# Altium schematic sheet S7CAS-PLEIADES-CARTE-MERE_P01_FPGA-BANK2.SchDoc
size Tabloid; DocumentNumber: 13; SheetNumber: 13; SheetTotal: 17; Sheet_Name: FPGA - BANK 2; Size: 11x17
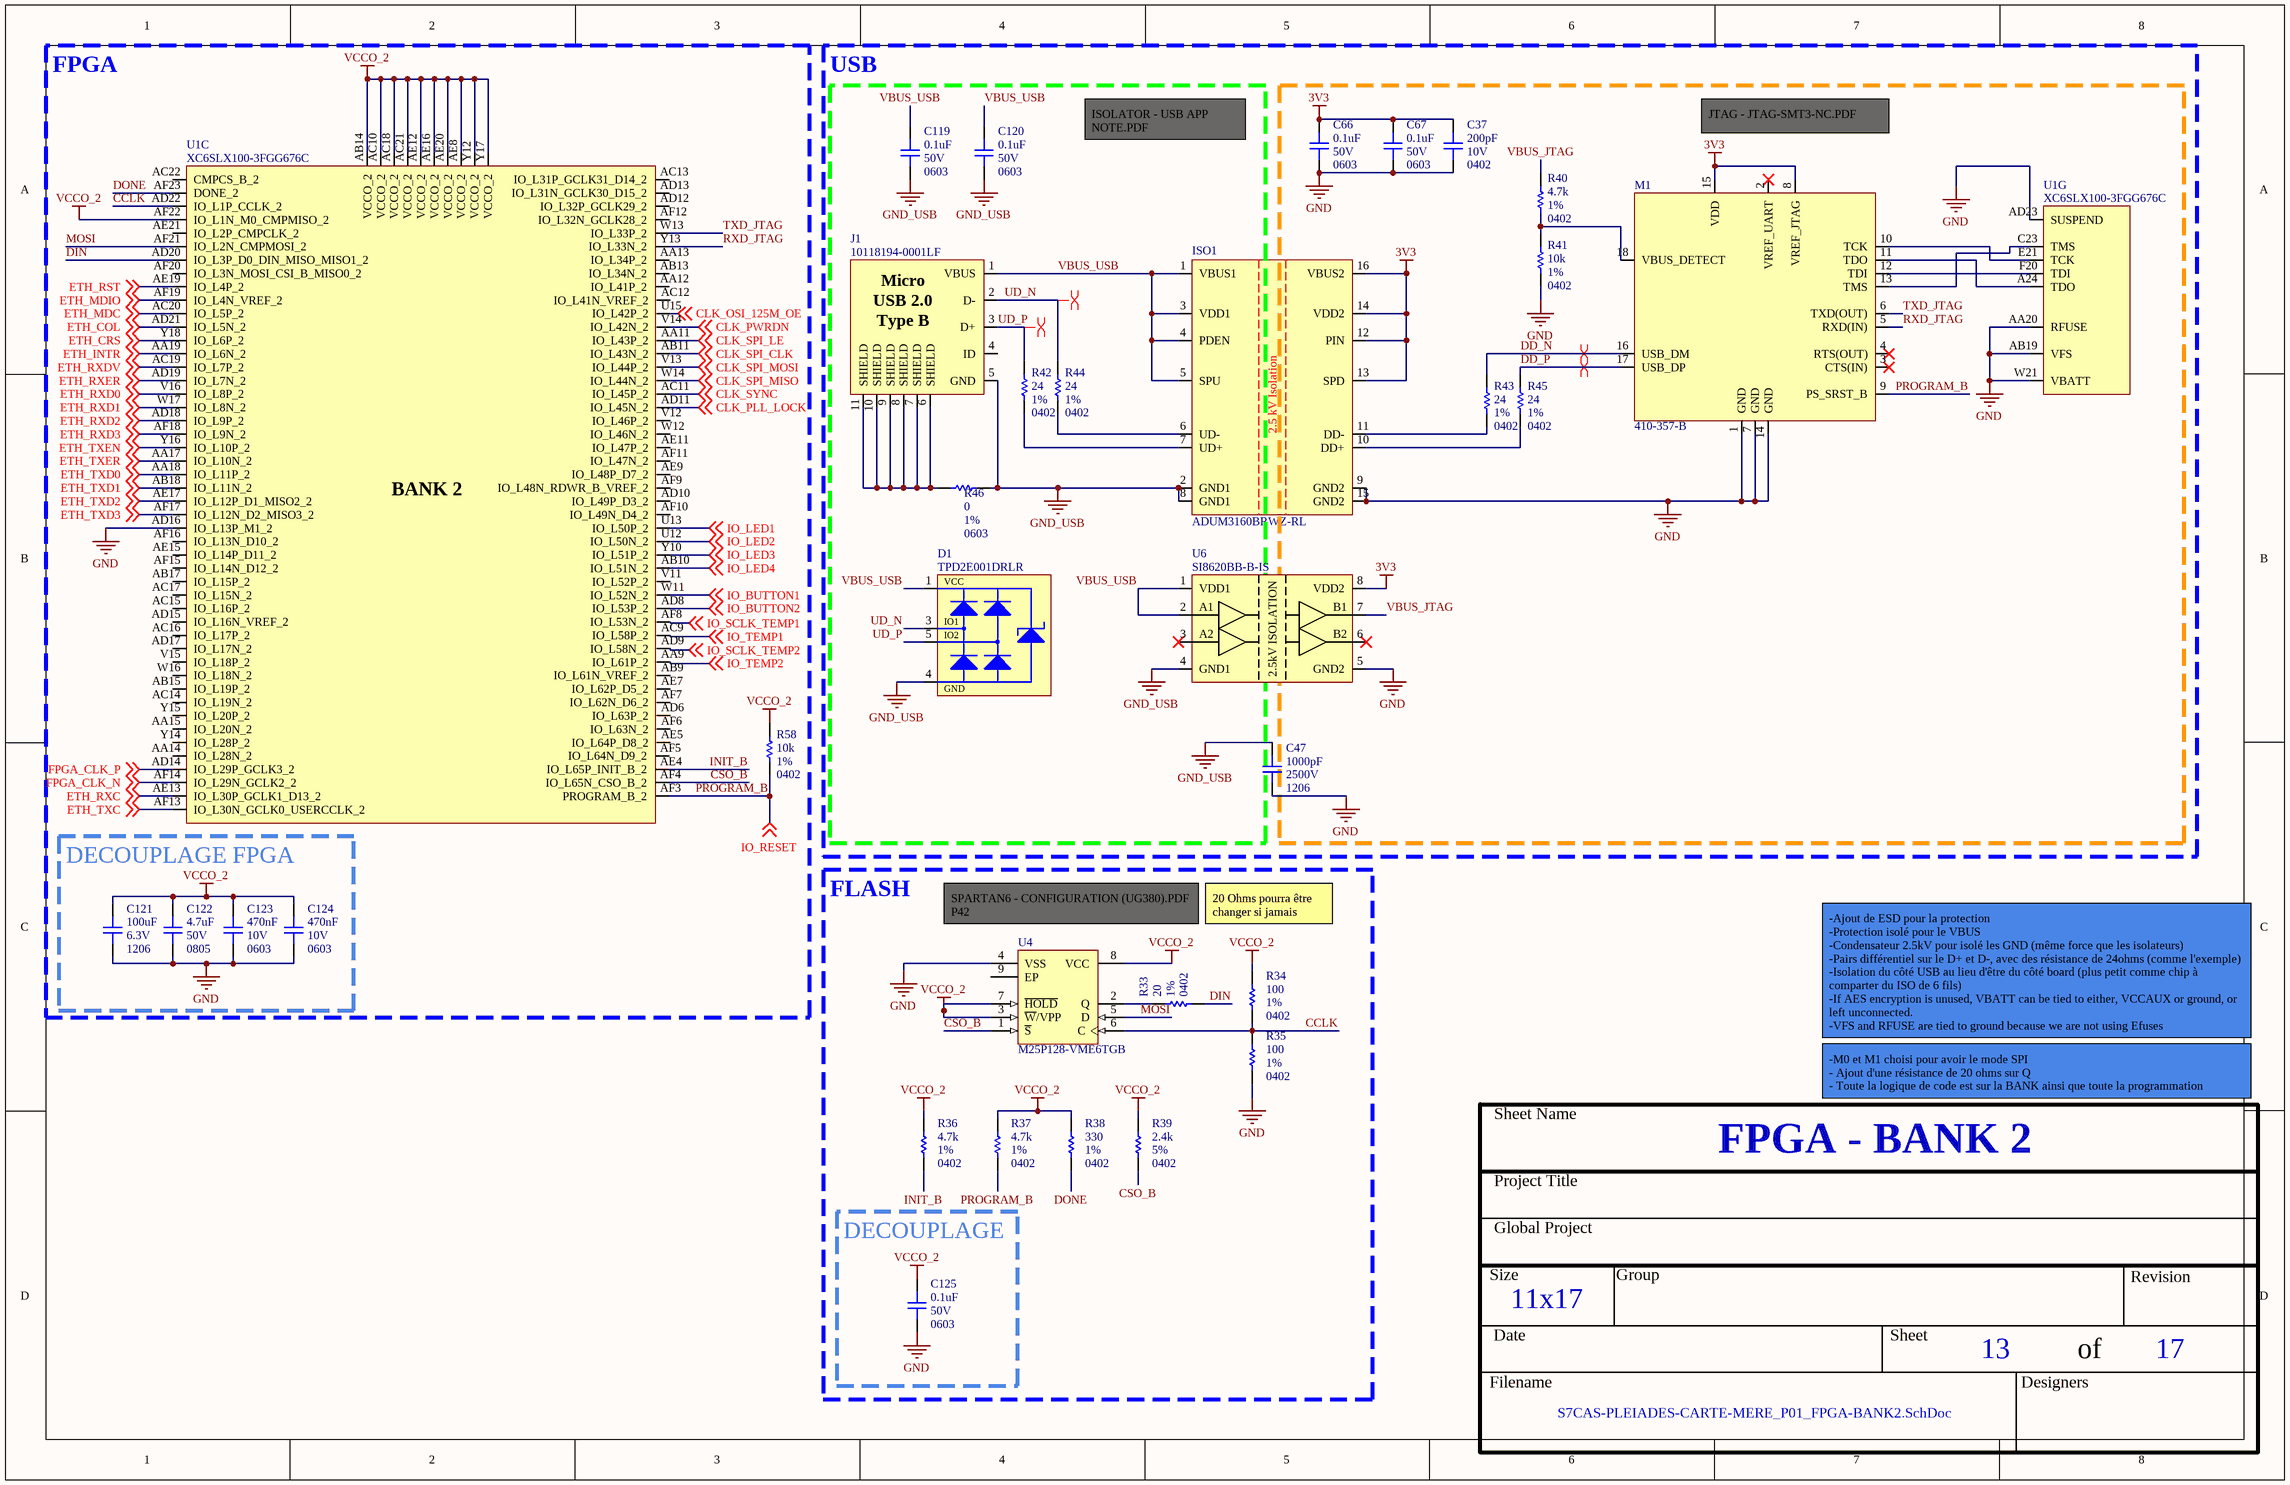
[diagram p0: S7CAS-PLEIADES-CARTE-MERE_P01_FPGA-BANK2.SchDoc]

## Parts
C37  value 200pF  Voltage: 10V  Package: 0402  [CAP_0402]  (hidden comment: CAP - 0402)
C47  value 1000pF  Voltage: 2500V  Package: 1206  [CAP_1206]  (hidden comment: CAP - 1206)
C66  value 0.1uF  Voltage: 50V  Package: 0603  [CAP_0603]  (hidden comment: CAP - 0603)
C67  value 0.1uF  Voltage: 50V  Package: 0603  [CAP_0603]  (hidden comment: CAP - 0603)
C119  value 0.1uF  Voltage: 50V  Package: 0603  [CAP_0603]  (hidden comment: CAP - 0603)
C120  value 0.1uF  Voltage: 50V  Package: 0603  [CAP_0603]  (hidden comment: CAP - 0603)
C121  value 100uF  Voltage: 6.3V  Package: 1206  [CAP_1206]  (hidden comment: CAP - 1206)
C122  value 4.7uF  Voltage: 50V  Package: 0805  [CAP_0805]  (hidden comment: CAP - 0805)
C123  value 470nF  Voltage: 10V  Package: 0603  [CAP_0603]  (hidden comment: CAP - 0603)
C124  value 470nF  Voltage: 10V  Package: 0603  [CAP_0603]  (hidden comment: CAP - 0603)
C125  value 0.1uF  Voltage: 50V  Package: 0603  [CAP_0603]  (hidden comment: CAP - 0603)
D1  TPD2E001DRLR  [TVS_USB_TPD2E001DRLR]
ISO1  ADUM3160BRWZ-RL  [ISO_ADUM3160BRWZ-RL]
J1  10118194-0001LF  [CON_USB_10118194-0001LF]
M1  410-357-B  [MOD_JTAG_410-357-B]
R33  value 20  Package: 0402  Precision: 1%  [RES_0402]  (hidden comment: RES - 0402)
R34  value 100  Package: 0402  Precision: 1%  [RES_0402]  (hidden comment: RES - 0402)
R35  value 100  Package: 0402  Precision: 1%  [RES_0402]  (hidden comment: RES - 0402)
R36  value 4.7k  Package: 0402  Precision: 1%  [RES_0402]  (hidden comment: RES - 0402)
R37  value 4.7k  Package: 0402  Precision: 1%  [RES_0402]  (hidden comment: RES - 0402)
R38  value 330  Package: 0402  Precision: 1%  [RES_0402]  (hidden comment: RES - 0402)
R39  value 2.4k  Package: 0402  Precision: 5%  [RES_0402]  (hidden comment: RES - 0402)
R40  value 4.7k  Package: 0402  Precision: 1%  [RES_0402]  (hidden comment: RES - 0402)
R41  value 10k  Package: 0402  Precision: 1%  [RES_0402]  (hidden comment: RES - 0402)
R42  value 24  Package: 0402  Precision: 1%  [RES_0402]  (hidden comment: RES - 0402)
R43  value 24  Package: 0402  Precision: 1%  [RES_0402]  (hidden comment: RES - 0402)
R44  value 24  Package: 0402  Precision: 1%  [RES_0402]  (hidden comment: RES - 0402)
R45  value 24  Package: 0402  Precision: 1%  [RES_0402]  (hidden comment: RES - 0402)
R46  value 0  Package: 0603  Precision: 1%  [RES_0603]  (hidden comment: RES - 0603)
R58  value 10k  Package: 0402  Precision: 1%  [RES_0402]  (hidden comment: RES - 0402)
U1  XC6SLX100-3FGG676C  [FPGA_XILINX_FGG676]  (parts C,G of 10)
U4  M25P128-VME6TGB  [MICT-VDFPN-8_M]
U6  SI8620BB-B-IS  [ISO_SI8620BB-B-IS]

## Blocks framed on the sheet
FPGA: R58 U1
USB: C119 C120 D1 J1 R42 R44 R46
DECOUPLAGE FPGA: C121-C124
FLASH: R33-R39 U4
DECOUPLAGE: C125

## Nets
3V3: C37.2 C66.2 C67.2 ISO1.12(PIN) ISO1.13(SPD) ISO1.14(VDD2) ISO1.16(VBUS2) M1.8(VREF_JTAG) M1.15(VDD) U6.8(VDD2)
GND: C37.1 C47.1 C66.1 C67.1 C121.1 C122.1 C123.1 C124.1 C125.1 ISO1.9(GND2) ISO1.15(GND2) M1.1(GND) M1.7(GND) M1.14(GND) R35.1 R41.1 U1.AA20(RFUSE) U1.AB19(VFS) U1.AD16(IO_L13P_M1_2) U1.AD23(SUSPEND) U1.W21(VBATT) U4.4(VSS) U6.5(GND2)
GND_USB: C47.2 C119.1 C120.1 D1.4(GND) ISO1.2(GND1) ISO1.8(GND1) J1.5(GND) R46.1 U6.4(GND1)
VCCO_2: C121.2 C122.2 C123.2 C124.2 C125.2 R34.2 R36.2 R37.2 R38.2 R39.2 R58.2 U1.AB14(VCCO_2) U1.AC10(VCCO_2) U1.AC18(VCCO_2) U1.AC21(VCCO_2) U1.AE8(VCCO_2) U1.AE12(VCCO_2) U1.AE16(VCCO_2) U1.AE20(VCCO_2) U1.AF22(IO_L1N_M0_CMPMISO_2) U1.Y12(VCCO_2) U1.Y17(VCCO_2) U4.3(~{W}/VPP) U4.7(~{HOLD}) U4.8(VCC)
CCLK: R34.1 R35.2 U1.AD22(IO_L1P_CCLK_2) U4.6(C)
CLK_OSI_125M_OE: U1.U15(IO_L42P_2) ; off-sheet CLK_OSI_125M_OE
CLK_PLL_LOCK: U1.AD11(IO_L45N_2) ; off-sheet CLK_PLL_LOCK
CLK_PWRDN: U1.V14(IO_L42N_2) ; off-sheet CLK_PWRDN
CLK_SPI_CLK: U1.AB11(IO_L43N_2) ; off-sheet CLK_SPI_CLK
CLK_SPI_LE: U1.AA11(IO_L43P_2) ; off-sheet CLK_SPI_LE
CLK_SPI_MISO: U1.W14(IO_L44N_2) ; off-sheet CLK_SPI_MISO
CLK_SPI_MOSI: U1.V13(IO_L44P_2) ; off-sheet CLK_SPI_MOSI
CLK_SYNC: U1.AC11(IO_L45P_2) ; off-sheet CLK_SYNC
CSO_B: R39.1 U1.AF4(IO_L65N_CSO_B_2) U4.1(~{S})
DD_N: M1.16(USB_DM) R43.2
DD_P: M1.17(USB_DP) R45.2
DIN: R33.1 U1.AD20(IO_L3P_D0_DIN_MISO_MISO1_2)
DONE: R38.1 U1.AF23(DONE_2)
ETH_COL: U1.AD21(IO_L5N_2) ; off-sheet ETH_COL
ETH_CRS: U1.Y18(IO_L6P_2) ; off-sheet ETH_CRS
ETH_INTR: U1.AA19(IO_L6N_2) ; off-sheet ETH_INTR
ETH_MDC: U1.AC20(IO_L5P_2) ; off-sheet ETH_MDC
ETH_MDIO: U1.AF19(IO_L4N_VREF_2) ; off-sheet ETH_MDIO
ETH_RST: U1.AE19(IO_L4P_2) ; off-sheet ETH_RST
ETH_RXC: U1.AE13(IO_L30P_GCLK1_D13_2) ; off-sheet ETH_RXC
ETH_RXD0: U1.V16(IO_L8P_2) ; off-sheet ETH_RXD0
ETH_RXD1: U1.W17(IO_L8N_2) ; off-sheet ETH_RXD1
ETH_RXD2: U1.AD18(IO_L9P_2) ; off-sheet ETH_RXD2
ETH_RXD3: U1.AF18(IO_L9N_2) ; off-sheet ETH_RXD3
ETH_RXDV: U1.AC19(IO_L7P_2) ; off-sheet ETH_RXDV
ETH_RXER: U1.AD19(IO_L7N_2) ; off-sheet ETH_RXER
ETH_TXC: U1.AF13(IO_L30N_GCLK0_USERCCLK_2) ; off-sheet ETH_TXC
ETH_TXD0: U1.AA18(IO_L11P_2) ; off-sheet ETH_TXD0
ETH_TXD1: U1.AB18(IO_L11N_2) ; off-sheet ETH_TXD1
ETH_TXD2: U1.AE17(IO_L12P_D1_MISO2_2) ; off-sheet ETH_TXD2
ETH_TXD3: U1.AF17(IO_L12N_D2_MISO3_2) ; off-sheet ETH_TXD3
ETH_TXEN: U1.Y16(IO_L10P_2) ; off-sheet ETH_TXEN
ETH_TXER: U1.AA17(IO_L10N_2) ; off-sheet ETH_TXER
FPGA_CLK_N: U1.AF14(IO_L29N_GCLK2_2) ; off-sheet FPGA_CLK_N
FPGA_CLK_P: U1.AD14(IO_L29P_GCLK3_2) ; off-sheet FPGA_CLK_P
INIT_B: R36.1 U1.AE4(IO_L65P_INIT_B_2)
IO_BUTTON1: U1.W11(IO_L52N_2) ; off-sheet IO_BUTTON1
IO_BUTTON2: U1.AD8(IO_L53P_2) ; off-sheet IO_BUTTON2
IO_LED1: U1.U13(IO_L50P_2) ; off-sheet IO_LED1
IO_LED2: U1.U12(IO_L50N_2) ; off-sheet IO_LED2
IO_LED3: U1.Y10(IO_L51P_2) ; off-sheet IO_LED3
IO_LED4: U1.AB10(IO_L51N_2) ; off-sheet IO_LED4
IO_SCLK_TEMP1: U1.AF8(IO_L53N_2) ; off-sheet IO_SCLK_TEMP1
IO_SCLK_TEMP2: U1.AD9(IO_L58N_2) ; off-sheet IO_SCLK_TEMP2
IO_TEMP1: U1.AC9(IO_L58P_2) ; off-sheet IO_TEMP1
IO_TEMP2: U1.AA9(IO_L61P_2) ; off-sheet IO_TEMP2
MOSI: U1.AF21(IO_L2N_CMPMOSI_2) U4.5(D)
PROGRAM_B: M1.9(PS_SRST_B) R37.1 R58.1 U1.AF3(PROGRAM_B_2) ; off-sheet IO_RESET  [also labelled IO_RESET]
RXD_JTAG: M1.5(RXD(IN)) U1.Y13(IO_L33N_2)
TXD_JTAG: M1.6(TXD(OUT)) U1.W13(IO_L33P_2)
UD_N: D1.3(IO1) J1.2(D-) R44.2
UD_P: D1.5(IO2) J1.3(D+) R42.2
VBUS_JTAG: R40.2 U6.7(B1)
VBUS_USB: C119.2 C120.2 D1.1(VCC) ISO1.1(VBUS1) ISO1.3(VDD1) ISO1.4(PDEN) ISO1.5(SPU) J1.1(VBUS) U6.1(VDD1) U6.2(A1)
NetISO1_6: ISO1.6(UD-) R44.1
NetISO1_7: ISO1.7(UD+) R42.1
NetISO1_10: ISO1.10(DD+) R45.1
NetISO1_11: ISO1.11(DD-) R43.1
NetJ1_6: J1.6(SHIELD) J1.7(SHIELD) J1.8(SHIELD) J1.9(SHIELD) J1.10(SHIELD) J1.11(SHIELD) R46.2
NetM1_10: M1.10(TCK) U1.E21(TCK)
NetM1_11: M1.11(TDO) U1.A24(TDO)
NetM1_12: M1.12(TDI) U1.F20(TDI)
NetM1_13: M1.13(TMS) U1.C23(TMS)
NetM1_18: M1.18(VBUS_DETECT) R40.1 R41.2
NetR33_2: R33.2 U4.2(Q)

Not connected (* = marked no-connect by the designer): D1 2(NC); J1 4(ID); M1 2(VREF_UART)* 3(CTS(IN))* 4(RTS(OUT))*; U1 AA12(IO_L41P_2) AA13(IO_L34P_2) AA14(IO_L28N_2) AA15(IO_L20N_2) AB9(IO_L61N_VREF_2) AB13(IO_L34N_2) AB15(IO_L19P_2) AB17(IO_L15P_2) AC12(IO_L41N_VREF_2) AC13(IO_L31P_GCLK31_D14_2) AC14(IO_L19N_2) AC15(IO_L16P_2) AC16(IO_L17P_2) AC17(IO_L15N_2) AC22(CMPCS_B_2) AD6(IO_L63P_2) AD10(IO_L49P_D3_2) AD12(IO_L32P_GCLK29_2) AD13(IO_L31N_GCLK30_D15_2) AD15(IO_L16N_VREF_2) AD17(IO_L17N_2) AE5(IO_L64P_D8_2) AE7(IO_L62P_D5_2) AE9(IO_L48P_D7_2) AE11(IO_L47P_2) AE15(IO_L14P_D11_2) AE21(IO_L2P_CMPCLK_2) AF5(IO_L64N_D9_2) AF6(IO_L63N_2) AF7(IO_L62N_D6_2) AF9(IO_L48N_RDWR_B_VREF_2) AF10(IO_L49N_D4_2) AF11(IO_L47N_2) AF12(IO_L32N_GCLK28_2) AF15(IO_L14N_D12_2) AF16(IO_L13N_D10_2) AF20(IO_L3N_MOSI_CSI_B_MISO0_2) V11(IO_L52P_2) V12(IO_L46P_2) V15(IO_L18P_2) W12(IO_L46N_2) W16(IO_L18N_2) Y14(IO_L28P_2) Y15(IO_L20P_2); U4 9(EP); U6 3(A2)* 6(B2)*

## Layout directives
differential pair; net class USB: DD_N, DD_P, UD_N, UD_P

## Notes on the sheet
- ISOLATOR - USB APP NOTE.PDF
- JTAG - JTAG-SMT3-NC.PDF
- (near U4) SPARTAN6 - CONFIGURATION (UG380).PDF
  P42
- 20 Ohms pourra être changer si jamais
- -Ajout de ESD pour la protection
  -Protection isolé pour le VBUS
  -Condensateur 2.5kV pour isolé les GND (même force que les isolateurs)
  -Pairs différentiel sur le D+ et D-, avec des résistance de 24ohms (comme l'exemple)
  -Isolation du côté USB au lieu d'être du côté board (plus petit comme chip à comparter du ISO de 6 fils)
  -If AES encryption is unused, VBATT can be tied to either, VCCAUX or ground, or left unconnected.
  -VFS and RFUSE are tied to ground because we are not using Efuses
- -M0 et M1 choisi pour avoir le mode SPI
  - Ajout d'une résistance de 20 ohms sur Q
  - Toute la logique de code est sur la BANK ainsi que toute la programmation
- Sheet Name
- Project Title
- Global Project
- Size
- Group
- Revision
- Date
- Sheet
- of
- Filename
- Designers
- (in symbol CON_USB_10118194-0001LF) Micro; USB 2.0; Type B
- (in symbol FPGA_XC6SLX100-3FGG676C, part C) BANK 2
- (in symbol ISO_ADUM3160BRWZ-RL) 2.5 kV Isolation
- (in symbol ISO_SI8620BB-B-IS) 2.5kV ISOLATION

## Library data of the parts
C37 = CAP - 0402: 200 pF ±10% 10V Ceramic Capacitor X8R 0402 (1005 Metric); Mfg Part Number: C0402C201K8HACTU; Mfg: KEMET; Current: *; CreatedBy: Jonathan Bouchard; Power: *; Precision: 10%; Part Number #1: C0402C201K8HACTU
C47 = CAP - 1206: 1000 pF ±10% 2500V (2.5kV) Ceramic Capacitor X7R 1206 (3216 Metric); Mfg Part Number: CC1206KKX7RSAB102; Mfg: YAGEO; Current: *; CreatedBy: Jonathan Bouchard; Power: *; Precision: 10%; Part Number #1: CC1206KKX7RSAB102
C66 C67 C119 C120 C125 = CAP - 0603: 0.1 µF ±10% 50V Ceramic Capacitor X7R 0603 (1608 Metric); Mfg Part Number: C0603C104K5RACTU; Mfg: KEMET; Current: *; CreatedBy: Jonathan Bouchard; Power: *; Precision: 10%
C121 = CAP - 1206: 100 µF ±20% 6.3V Ceramic Capacitor X6T 1206 (3216 Metric); Mfg Part Number: GRM31CD80J107MEA8K; Mfg: Murata Electronics; Current: *; CreatedBy: Jonathan Bouchard; Power: *; Precision: 20%
C122 = CAP - 0805: 4.7 µF ±10% 50V Ceramic Capacitor X5R 0805 (2012 Metric); Mfg Part Number: GRT21BR61H475KE13L; Mfg: Murata Electronics; Current: *; CreatedBy: Jonathan Bouchard; Power: *; Precision: 10%
C123 C124 = CAP - 0603: Mfg Part Number: C0603X474K8RAC; Precision: 10%; Current: *; CreatedBy: Jonathan Bouchard; Power: *
D1 = TVS_USB_TPD2E001DRLR: TVS - USB TVS DIODE 5.5V - SOT-553; Manufacturer #1: Texas Instruments; Value: 11V Breakdown; Voltage Rating: 5.5V (Max); GRAMS Lib Spec: 2.8; Magnetic Material: YES; Cryo: UNKNOWN; Tolerance: *; Current Rating: *; Power Max: *; HelpURL: http://www.ti.com/lit/ds/symlink/tpd2e001.pdf; CreatedBy/Date: Jonathan Bouchard 2018-07-10; VerifiedBy: Arnaud Samson 16-07-18; Temperature: -40°C ~ 85°C (TA); Package: SOT-553; Manufacturer #2: *; Part Number #2: *; Part Number #1: TPD2E001DRLR; Polarized: YES; Supplier 1: Digi-Key; Supplier Part Number 1: 296-21883-1-ND; Mfg Part Number: TPD2E001DRLR
ISO1 = ISO_ADUM3160BRWZ-RL: ISO - DGTL ISO 2.5KV 2CH USB - 16SOIC; Manufacturer #1: Analog Devices; Value: 2500Vrms voltage isolation; Voltage Rating: 3~5.5V; GRAMS Lib Spec: 2.8; Magnetic Material: UNKNOWN; Polarized: Yes; Tolerance: *; Current Rating: *; Power Max: *; HelpURL: https://www.analog.com/media/en/technical-documentation/data-sheets/ADuM3160.pdf; CreatedBy/Date: Tommy Rossignol 2018-11-16; VerifiedBy: Caroline Paulin - 13 février 2019; Temperature: -40°C ~ 105°C; Package: 16-SOIC; Manufacturer #2: *; Part Number #2: *; Part Number #1: ADUM3160BRWZ-RL; Supplier 1: Digi-Key; Supplier Part Number 1: ADUM3160BRWZ-RLCT-ND; Cryo: UNKNOWN; Mfg Part Number: ADUM3160BRWZ-RL
J1 = CON_USB_10118194-0001LF: CON - USB MICRO B RECPT SMT R/A - 4PIN; Manufacturer #1: Amphenol FCI; Value: USB - Micro B; Voltage Rating: 100VAC; Current Rating: 1.8A; GRAMS Lib Spec: 2.8; Magnetic Material: YES; Cryo: UNKNOWN; Tolerance: *; Power Max: *; HelpURL: https://cdn.amphenol-icc.com/media/wysiwyg/files/drawing/10118194.pdf; CreatedBy/Date: Arnaud Samson - 09/07/18; VerifiedBy: Jonathan Bouchard 2018-07-12; Temperature: -30°C ~ 80°C; Package: 5-SMD; Manufacturer #2: *; Part Number #2: *; Part Number #1: 10118194-0001LF; Polarized: YES; Supplier 1: Digi-Key; Supplier Part Number 1: 609-4618-1-ND; Mfg Part Number: 10118194-0001LF
M1 = MOD_JTAG_410-357-B: MOD - JTAG-SMT3-NC Programming Module For Xilinx FPGA - 18-SMT; Manufacturer #1: Digilent; Voltage Rating: VDD: 2.97V~3.63V, VJTAG/VUART: 1.65V~5.5V; GRAMS Lib Spec: 2.8; Magnetic Material: Unknown; Polarized: Yes; Value: *; Tolerance: *; Current Rating: *; Power Max: *; HelpURL: https://reference.digilentinc.com/_media/reference/programmers/jtag-smt3/jtag-smt3-nc_rm.pdf; CreatedBy/Date: Tommy Rossignol 2018-11-23; VerifiedBy: Nicolas V. (2019-01-28); Temperature: -40°C ~ 85°C; Package: 18-pad SMT; Manufacturer #2: *; Part Number #2: *; Part Number #1: 410-357-B; Supplier 1: Digi-Key; Supplier Part Number 1: 1286-1196-ND; Cryo: UNKNOWN; Mfg Part Number: 410-357-B
R33 = RES - 0402: 20 Ohms ±1% 0.063W, 1/16W Chip Resistor 0402 (1005 Metric) Moisture Resistant Thick Film; Mfg Part Number: RC0402FR-0720RL; Voltage: 75V; Current: *; CreatedBy: Jonathan Bouchard; Power: 1/16W; Part Number #1: RC0402FR-0720RL
R34 R35 = RES - 0402: 100 Ohms ±1% 0.1W, 1/10W Chip Resistor 0402 (1005 Metric) Automotive AEC-Q200 Thick Film; Mfg Part Number: RK73H1ETTP1000F; Voltage: 75V; Current: *; CreatedBy: Jonathan Bouchard; Power: 1/10W; Part Number #1: RK73H1ETTP1000F
R36 R37 R40 = RES - 0402: 4.7 kOhms ±1% 0.063W, 1/16W Chip Resistor 0402 (1005 Metric) Moisture Resistant Thick Film; Mfg Part Number: RC0402FR-074K7L; Voltage: 50V; Current: *; CreatedBy: Jonathan Bouchard; Power: 1/16W; Part Number #1: RC0402FR-074K7L
R38 = RES - 0402: 330 Ohms ±1% 0.063W, 1/16W Chip Resistor 0402 (1005 Metric) Moisture Resistant Thick Film; Mfg Part Number: RC0402FR-07330RL; Voltage: 50V; Current: *; CreatedBy: Jonathan Bouchard; Power: 1/16W; Part Number #1: RC0402FR-07330RL
R39 = RES - 0402: 2.4 kOhms ±5% 0.063W, 1/16W Chip Resistor 0402 (1005 Metric) Moisture Resistant Thick Film; Mfg Part Number: RC0402JR-072K4L; Voltage: 50V; Current: *; CreatedBy: Jonathan Bouchard; Power: 1/16W; Part Number #1: RC0402JR-072K4L
R41 R58 = RES - 0402: 10 kOhms ±1% 0.063W, 1/16W Chip Resistor 0402 (1005 Metric) Automotive AEC-Q200 Thick Film; Mfg Part Number: RMCF0402FT10K0; Voltage: 75V; Current: *; CreatedBy: Jonathan Bouchard; Power: 1/16W; Part Number #1: RMCF0402FT10K0
R42-R45 = RES - 0402: 24 Ohms ±1% 0.063W, 1/16W Chip Resistor 0402 (1005 Metric) Moisture Resistant Thick Film; Mfg Part Number: RC0402FR-0724RL; Voltage: 50V; Current: *; CreatedBy: Jonathan Bouchard; Power: 1/16W; Part Number #1: RC0402FR-0724RL
R46 = RES - 0603: 0 Ohms Jumper Chip Resistor 0603 (1608 Metric) Automotive AEC-Q200 Thick Film; Mfg Part Number: ERJ-3GEY0R00V; Voltage: 75V; Mfg: Panasonic Electronic Components; Current: *; CreatedBy: Jonathan Bouchard; Part Number #1: ERJ-3GEY0R00V
U1 = FPGA_XC6SLX100-3FGG676C: FPGA - XILINX SPARTAN 6 480 I/O - BGA-676; Voltage: 1.14 V ~ 1.26 V; Current: *; Power: *; Mfg: Xilinx; Mfg Part Number: XC6SLX100-3FGG676C; HelpURL: https://www.xilinx.com/support/documentation/data_sheets/ds162.pdf; CreatedBy: Jonathan Bouchard; Temperature: 0°C ~ 85°C (TJ); Value: *; Precision: *; Package: BGA-676; Supplier 1: Digikey; Supplier Part Number 1: 122-1760-ND; Part Number #1: XC6SLX100-3FGG676C
U4 = CMP-0677-00004-1: Low-Voltage, Serial Flash Memory with SPI Bus Interface, 128 Mbit, 54 MHz, 2.7 to 3.6 V, 8-Pin VDFPN (MLP), RoHS, Tape and Reel; Supply Voltage Min: 2.7 V; Supply Voltage Max: 3.6 V; Memory Size: 128 Mbits; Temperature Max: 85 degC; PackageDescription: 8-Pin Very Thin Dual Flat Package No lead, Body 8 x 6 mm, Pitch 1.27 mm; Generic Part Number: M25P128; DatasheetVersion: Rev. 6; Packing: Tape and Reel; RoHS: TRUE; PartNumber: M25P128-VME6TGB; Temperature Min: -40 degC; Mfg Part Number: M25P128-VME6TGB; Part Number #1: M25P128-VME6TGB
U6 = ISO_SI8620BB-B-IS: ISO - Dual-Channel Digital Isolator (default Low) - 8-SOIC; Manufacturer #1: Silicon Labs; Voltage Rating: 2.5-5.5V; GRAMS Lib Spec: 2.8; Magnetic Material: Unknown; Polarized: Yes; Value: *; Tolerance: *; Current Rating: *; Power Max: *; HelpURL: https://www.silabs.com/documents/public/data-sheets/si861x-2x-datasheet.pdf; CreatedBy/Date: Joel Lemay 2018-06-05; VerifiedBy: Caroline Paulin - 12 sept 2018; Temperature: -40°C ~ 125°C; Package: 8-SOIC; Manufacturer #2: *; Part Number #2: *; Part Number #1: SI8620BB-B-IS; Supplier 1: Digi-Key; Supplier Part Number 1: 336-2567-ND; Cryo: UNKNOWN; Mfg Part Number: SI8620BB-B-IS